# EAGLE design OTAVCF (EAGLE 9.5.2)
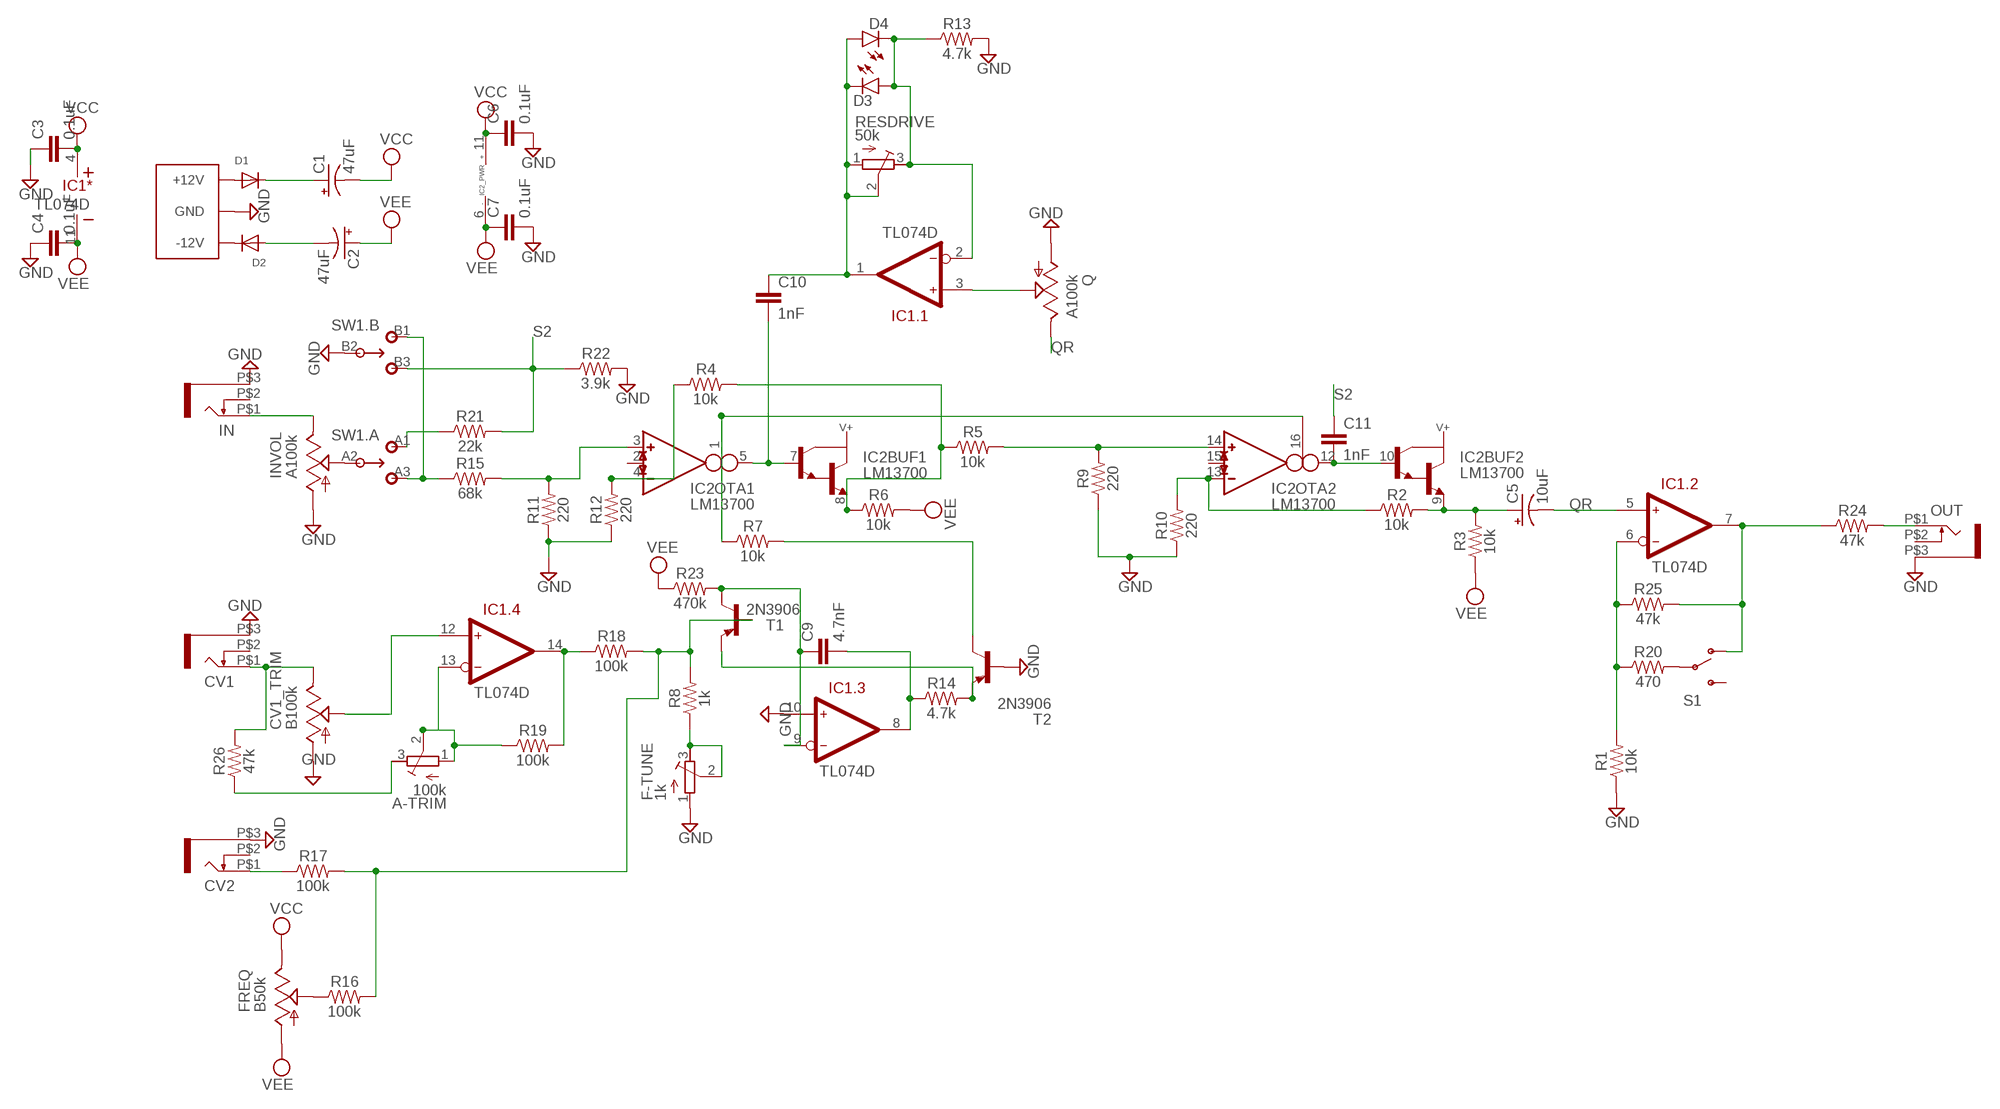
[diagram p0: schematic, sheet 1]

## Parts
A-TRIM  100k  R-TRIMM3296W  [RTRIM3296W]
C1  47uF  CAP_SMD+THRUPAN_B  [PAN_B_SMD+THRU]
C2  47uF  CAP_SMD+THRUPAN_B  [PAN_B_SMD+THRU]
C3  0.1uF  0.1UF-0603-25V-(+80/-20%)  [0603]
C4  0.1uF  0.1UF-0603-25V-(+80/-20%)  [0603]
C5  10uF  10UF-POLAR-RADIAL-2.5MM-25V-20%  [CPOL-RADIAL-2.5MM-5MM]
C6  0.1uF  0.1UF-0603-25V-(+80/-20%)  [0603]
C7  0.1uF  0.1UF-0603-25V-(+80/-20%)  [0603]
C9  4.7nF  0.1UF-0603-25V-(+80/-20%)  [0603]
C10  1nF  1.0NF/1000PF-0603-50V-10%  [0603]
C11  1nF  1.0NF/1000PF-0603-50V-10%  [0603]
CV1  WQP-PJ301M-12_JACK  [WQP-PJ301M-12_JACK]
CV1_TRIM  B100k  9MM_SNAP-IN_POT_  [9MM_SNAP-IN_POT]
CV2  WQP-PJ301M-12_JACK  [WQP-PJ301M-12_JACK]
D1  DIODESOD-123  [SOD-123]
D2  DIODESOD-123  [SOD-123]
D3  LED.3  [3MM_2]
D4  LED.3  [3MM_2]
F-TUNE  1k  R-TRIMM3296W  [RTRIM3296W]
FREQ  B50k  9MM_SNAP-IN_POT_  [9MM_SNAP-IN_POT]
IC1  TL074D  [SO-14]
IC2  LM13700  LM13X00_SMT  [SO16]
IN  WQP-PJ301M-12_JACK  [WQP-PJ301M-12_JACK]
INVOL  A100k  9MM_SNAP-IN_POT_  [9MM_SNAP-IN_POT]
OUT  WQP-PJ301M-12_JACK  [WQP-PJ301M-12_JACK]
Q  A100k  9MM_SNAP-IN_POT_  [9MM_SNAP-IN_POT]
R1  10k  10KOHM-0603-1/10W-1%  [0603]
R2  10k  10KOHM-0603-1/10W-1%  [0603]
R3  10k  10KOHM-0603-1/10W-1%  [0603]
R4  10k  10KOHM-0603-1/10W-1%  [0603]
R5  10k  10KOHM-0603-1/10W-1%  [0603]
R6  10k  10KOHM-0603-1/10W-1%  [0603]
R7  10k  10KOHM-0603-1/10W-1%  [0603]
R8  1k  1KOHM-0603-1/10W-1%  [0603]
R9  220  220OHM-0603-1/10W-1%  [0603]
R10  220  220OHM-0603-1/10W-1%  [0603]
R11  220  220OHM-0603-1/10W-1%  [0603]
R12  220  220OHM-0603-1/10W-1%  [0603]
R13  4.7k  4.7KOHM-0603-1/10W-1%  [0603]
R14  4.7k  4.7KOHM-0603-1/10W-1%  [0603]
R15  68k  RESISTOR0603  [0603]
R16  100k  100KOHM-0603-1/10W-1%  [0603]
R17  100k  100KOHM-0603-1/10W-1%  [0603]
R18  100k  100KOHM-0603-1/10W-1%  [0603]
R19  100k  100KOHM-0603-1/10W-1%  [0603]
R20  470  470OHM-0603-1/10W-1%  [0603]
R21  22k  22KOHM-0603-1/10W-1%  [0603]
R22  3.9k  3.9KOHM-0603-1/10W-1%  [0603]
R23  470k  RESISTOR0603  [0603]
R24  47k  47KOHM-0603-1/10W-1%  [0603]
R25  47k  47KOHM-0603-1/10W-1%  [0603]
R26  47k  47KOHM-0603-1/10W-1%  [0603]
RESDRIVE  50k  R-TRIMM3296W  [RTRIM3296W]
S1  SUBMINI_SPDT  [SUBMINI_TOGGLE]
SW1  DPDT.LUGS  [DPDT.LUGS]
T1  2N3906  BC807-40-PNP-SOT23-BEC  [SOT23-BEC]
T2  2N3906  BC807-40-PNP-SOT23-BEC  [SOT23-BEC]
U$1  EURO_POWER_LOCK  [EURO_PWR_HEADER_LOCK]

## Nets
BCVIN: R8.2 R16.2 R17.2 R18.2 T1.B
GND: C3.1 C4.1 C6.2 C7.2 CV1.P$3 CV1_TRIM.1(A) CV2.P$3 F-TUNE.1(A) IC1.10(.3:IN+) IN.P$3 INVOL.1(A) OUT.P$3 Q.1(A) R1.1 R9.1 R10.1 R11.1 R12.1 R13.2 R22.2 SW1.B2 T2.B U$1.GND1(GND) U$1.GND2(GND) U$1.GND3(GND) U$1.GND4(GND) U$1.GND5(GND) U$1.GND6(GND)
N$1: D1.A U$1.POS1(+12V) U$1.POS2(+12V)
N$2: D2.C U$1.NEG1(-12V) U$1.NEG2(-12V)
N$3: C1.+ C1.++(+) D1.C
N$4: C2.- C2.--(-) D2.A
N$5: IN.P$1 INVOL.3(E)
N$6: INVOL.2(S) SW1.A2
N$7: R15.1 SW1.A3 SW1.B1
N$8: R21.1 SW1.A1
N$9: CV1.P$1 CV1_TRIM.3(E) R26.2
N$10: A-TRIM.1(A) A-TRIM.2(S) IC1.13(.4:IN-) R19.1
N$11: IC1.14(.4:OUT) R18.1 R19.2
N$12: F-TUNE.2(S) F-TUNE.3(E) R8.1
N$13: CV2.P$1 R17.1
N$14: A-TRIM.3(E) R26.1
N$15: CV1_TRIM.2(S) IC1.12(.4:IN+)
N$16: FREQ.2(S) R16.1
N$17: C9.1 IC1.9(.3:IN-) R23.2 T1.C
N$18: C9.2 IC1.8(.3:OUT) R14.1
N$19: R14.2 T1.E T2.E
N$20: IC2.3(OTA1:IN_P) R11.2 R15.2
N$21: IC2.4(OTA1:IN_N) R4.1 R12.2
N$22: IC2.1(OTA1:I_BIAS) IC2.16(OTA2:I_BIAS) R7.1
N$23: R7.2 T2.C
N$24: IC2.8(BUF1:E) R4.2 R5.1 R6.1
N$25: C10.2 IC2.5(OTA1:OUT) IC2.7(BUF1:B)
N$26: C11.2 IC2.10(BUF2:B) IC2.12(OTA2:OUT)
N$27: IC2.14(OTA2:IN_P) R5.2 R9.2
N$28: IC2.13(OTA2:IN_N) R2.1 R10.2
N$29: C5.1(+) IC2.9(BUF2:E) R2.2 R3.2
N$30: IC1.6(.2:IN-) R1.2 R20.1 R25.1
N$31: R20.2 S1.COM(COMMON)
N$32: IC1.7(.2:OUT) R24.1 R25.2 S1.1(O)
N$33: OUT.P$1 R24.2
N$34: C10.1 D3.P$1(C) D4.ANODE(A) IC1.1(.1:OUT) RESDRIVE.1(A) RESDRIVE.2(S)
N$35: D3.ANODE(A) D4.P$1(C) IC1.2(.1:IN-) R13.1 RESDRIVE.3(E)
N$36: IC1.3(.1:IN+) Q.2(S)
QR: C5.2(-) IC1.5(.2:IN+) Q.3(E)
S2: C11.1 R21.2 R22.1 SW1.B3
VCC: C1.- C1.--(-) C3.2 C6.1 FREQ.3(E) IC1.4(*:V+) IC2.11(_PWR:V+)
VEE: C2.+ C2.++(+) C4.2 C7.1 FREQ.1(A) IC1.11(*:V-) IC2.6(_PWR:V-) R3.1 R6.2 R23.1
Unconnected: CV1.P$2 CV2.P$2 IC2.2(OTA1:I_DIODE) IC2.15(OTA2:I_DIODE) IN.P$2 OUT.P$2 S1.3(S)

## Library data of the parts
A-TRIM F-TUNE RESDRIVE = resistor:R-TRIMM: Trimm resistor
C1 C2 = MusicThingModular:CAP_SMD+THRU
C3 C4 C6 C7 = SparkFun-Capacitors:0.1UF: 0.1µF ceramic capacitors A capacitor is a passive two-terminal electrical component used to store electrical energy temporarily in an electric field.; PROD_ID: CAP-00810
C5 = SparkFun-Capacitors:10UF-POLAR: 10.0µF polarized capacitors A capacitor is a passive two-terminal electrical component used to store electrical energy temporarily in an electric field.; PROD_ID: CAP-08440
C9 = SparkFun-Capacitors:0.1UF: 0.1µF ceramic capacitors A capacitor is a passive two-terminal electrical component used to store electrical energy temporarily in an electric field.; PROD_ID: CAP-00810; VALUE: 0.1uF
C10 C11 = SparkFun-Capacitors:1.0NF/1000PF: 1nF/1,000pF ceramic capacitors A capacitor is a passive two-terminal electrical component used to store electrical energy temporarily in an electric field.; PROD_ID: CAP-07886
CV1 CV2 IN OUT = thonkiconn:WQP-PJ301M-12_JACK
CV1_TRIM FREQ INVOL Q = MusicThingModular:9MM_SNAP-IN_POT: 9mm vertical snap-in pot, Alpha / Panasonic style
D1 D2 = adafruit:DIODE: Diode SMADIODE - SMA Surface Mount Package 20V 1A Schottky Diode Digikey: 641-1014-6-ND DO-1N4148 - Through Hole Small Current Diode SOD-123 20V 1 A (.5mV Vf) Schottky Diode - Digikey: MBRX120TPMSCT-ND SOD-323 10V 570mA (.38mV Vf, 3ns) Schottky Diode - Digikey: ZLLS410CT-ND SOD-523 30V 30mA Schottky Diode (RB751S-40TE61) - Digikey: RB751S-40TE61CT-ND SOT23-R/W - SOT23 Package (R = Solder Paste/Reflow Ovens, W = Hand-Soldering) BAT54Film 40V 300mA - Digikey: 497-7162-1-ND
D3 D4 = diodes:LED: LEDs, all sizes 3mm: http://smallbear-electronics.mybigcommerce.com/led-t-1-3mm-diffused-colors/ 5mm: http://smallbear-electronics.mybigcommerce.com/led-t-1-3-4-5mm-diffused/
IC1 = ic-ti:TL074
IC2 = ota:LM13X00: Dual OTA with buffers Through Hole: LM13700: http://www.mouser.com/ProductDetail/Texas-Instruments/LM13700N-NOPB/?qs=sGAEpiMZZMtDSiRz%252bYolvD8n5VWKm6dLW3h72fOl2XA%3d LM13600: http://smallbear-electronics.mybigcommerce.com/ic-njm13600d/ Surface Mount: LM13700: http://www.mouser.com/ProductDetail/Texas-Instruments/LM13700MX-NOPB/?qs=sGAEpiMZZMtDSiRz%252bYolvD8n5VWKm6dLlyXbqS8bD%252bg%3d
R1-R7 = SparkFun-Resistors:10KOHM: 10kΩ resistor A resistor is a passive two-terminal electrical component that implements electrical resistance as a circuit element. Resistors act to reduce current flow, and, at the same time, act to lower voltage levels within circuits. - Wikipedia; PROD_ID: RES-00824
R8 = SparkFun-Resistors:1KOHM: 1kΩ resistor A resistor is a passive two-terminal electrical component that implements electrical resistance as a circuit element. Resistors act to reduce current flow, and, at the same time, act to lower voltage levels within circuits. - Wikipedia; PROD_ID: RES-07856
R9-R12 = SparkFun-Resistors:220OHM: 220Ω resistor A resistor is a passive two-terminal electrical component that implements electrical resistance as a circuit element. Resistors act to reduce current flow, and, at the same time, act to lower voltage levels within circuits. - Wikipedia; PROD_ID: RES-07861
R13 R14 = SparkFun-Resistors:4.7KOHM: 4.7kΩ resistor A resistor is a passive two-terminal electrical component that implements electrical resistance as a circuit element. Resistors act to reduce current flow, and, at the same time, act to lower voltage levels within circuits. - Wikipedia; PROD_ID: RES-07857
R15 R23 = SparkFun-Resistors:RESISTOR: Generic Resistor Package
R16-R19 = SparkFun-Resistors:100KOHM: 100kΩ resistor A resistor is a passive two-terminal electrical component that implements electrical resistance as a circuit element. Resistors act to reduce current flow, and, at the same time, act to lower voltage levels within circuits. - Wikipedia; PROD_ID: RES-07828
R20 = SparkFun-Resistors:470OHM: 470Ω resistor A resistor is a passive two-terminal electrical component that implements electrical resistance as a circuit element. Resistors act to reduce current flow, and, at the same time, act to lower voltage levels within circuits. - Wikipedia; PROD_ID: RES-07869
R21 = SparkFun-Resistors:22KOHM: 22kΩ resistor A resistor is a passive two-terminal electrical component that implements electrical resistance as a circuit element. Resistors act to reduce current flow, and, at the same time, act to lower voltage levels within circuits. - Wikipedia; PROD_ID: RES-07853
R22 = SparkFun-Resistors:3.9KOHM: 3.9kΩ resistor A resistor is a passive two-terminal electrical component that implements electrical resistance as a circuit element. Resistors act to reduce current flow, and, at the same time, act to lower voltage levels within circuits. - Wikipedia; PROD_ID: RES-08701
R24-R26 = SparkFun-Resistors:47KOHM: 47kΩ resistor A resistor is a passive two-terminal electrical component that implements electrical resistance as a circuit element. Resistors act to reduce current flow, and, at the same time, act to lower voltage levels within circuits. - Wikipedia; PROD_ID: RES-07871
S1 = MusicThingModular:SUBMINI_SPDT
SW1 = switches:DPDT: DPDT Switches
T1 T2 = MusicThingModular:*-PNP-: PNP Transistror
U$1 = MusicThingModular:EURO_POWER_LOCK

## Board
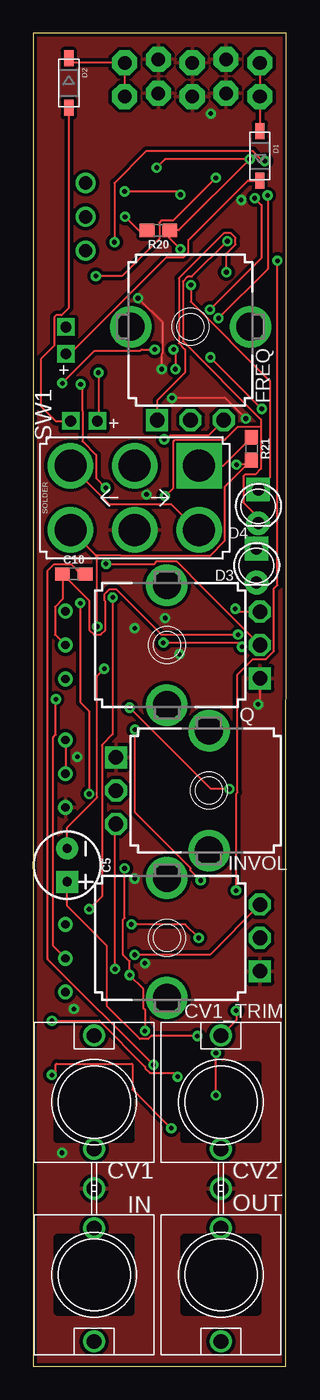
[diagram p1: board, top side]
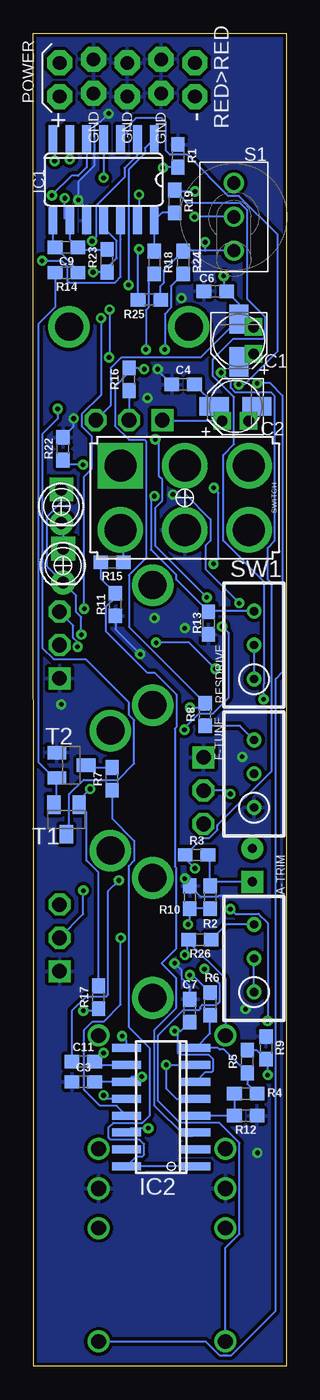
[diagram p2: board, bottom side, seen from below]

Size 19 x 100 mm. Coordinates in mm from the lower left corner, seen from the top.
Outline: 0,0 18.97,0 19,100 0,100 0,0
Copper layers (1*16): Top 0.035mm / dielectric 1.5mm / Bottom 0.035mm
Design rules "default *": minimum track width 6mil, minimum drill 0.35mm, track to track 6mil, track to pad 6mil, pad to pad 6mil, via to via 6mil, smd to smd 6mil, copper to edge 6mil, drill to drill 6mil, minimum pad ring 10mil, minimum via ring 8mil, stop-mask expansion 4mil, vias tented up to drill 0mil, thermal gap 10mil

### Footprints (pad centres in the part's own frame; a part is rotated, then mirrored left to right if it is on the bottom)
RTRIM3296W = drill 0.61: 1 0,-2.54; 2 0,0; 3 0,2.54
PAN_B_SMD+THRU = smd 2.2 x 1.4: + 1.6,0; - -1.6,0 | drill 0.8 pad 0.9 square: ++ 1,1.1; -- -1,1.1
0603 = smd 1.1 x 1: 1 -0.85,0; 2 0.85,0
CPOL-RADIAL-2.5MM-5MM = drill 0.7 pad 1.651 square: 1 1.25,0 | drill 0.7 pad 1.651: 2 -1.25,0
WQP-PJ301M-12_JACK = drill 1.1: P$1 0,5; P$2 0,-3.5; P$3 0,-6.5
9MM_SNAP-IN_POT = drill 1.1 square: 1 -2.5,-7 | drill 1.1 octagon: 2 0,-7; 3 2.5,-7 | drill 2.1 pad 2.794: CHASSIS1 -4.5,0; CHASSIS2 4.5,0
SOD-123 = smd 1.2 x 0.7: A 1.85,0; C -1.85,0
3MM_2 = drill 0.9 pad 1.778 square: ANODE -1.27,0 | drill 0.9 pad 1.778: P$1 1.27,0
SO-14 = smd 0.66 x 2.032: 1 -3.81,-3.073; 2 -2.54,-3.073; 3 -1.27,-3.073; 4 0,-3.073; 5 1.27,-3.073; 6 2.54,-3.073; 7 3.81,-3.073; 8 3.81,3.073; 9 2.54,3.073; 10 1.27,3.073; 11 0,3.073; 12 -1.27,3.073; 13 -2.54,3.073; 14 -3.81,3.073
SO16 = smd 0.6 x 2.2: 1 -4.445,-2.6; 2 -3.175,-2.6; 3 -1.905,-2.6; 4 -0.635,-2.6; 5 0.635,-2.6; 6 1.905,-2.6; 7 3.175,-2.6; 8 4.445,-2.6; 9 4.445,2.6; 10 3.175,2.6; 11 1.905,2.6; 12 0.635,2.6; 13 -0.635,2.6; 14 -1.905,2.6; 15 -3.175,2.6; 16 -4.445,2.6
SUBMINI_TOGGLE = drill 1 pad 1.422: 1 -2.54,0; 3 2.54,0; COM 0,0
DPDT.LUGS = drill 2.4 square: A1 -2.413,4.834 | drill 2.4: A2 -2.413,0.004; A3 -2.413,-4.826; B1 2.417,4.834; B2 2.417,0.004; B3 2.417,-4.826
SOT23-BEC = smd 1 x 1.4: B -0.95,-1.1; C 0,1.1; E 0.95,-1.1
EURO_PWR_HEADER_LOCK = drill 1.016 pad 1.88 octagon: GND1 -2.54,1.143; GND2 -2.54,-1.397; GND3 0,1.397; GND4 0,-1.143; GND5 2.54,1.143; GND6 2.54,-1.397; NEG1 -5.08,1.397; NEG2 -5.08,-1.143; POS1 5.08,1.397; POS2 5.08,-1.143

### Placement (x,y rotation side)
A-TRIM  2.41,30.61 0 bottom
C1  3.56,76.96 270 bottom
C2  3.81,72.01 180 bottom
C3  15.24,21.34 0 bottom
C4  7.75,73.66 0 bottom
C5  2.54,37.59 270 top
C6  5.33,80.64 180 bottom
C7  7.24,26.67 90 bottom
C9  16.51,83.95 180 bottom
C10  3.05,59.44 0 top
C11  15.24,22.86 0 bottom
CV1  4.57,19.81 0 top
CV1_TRIM  10.03,32.13 90 top
CV2  14.1,19.81 0 top
D1  17.02,90.81 90 top
D2  2.67,96.27 270 top
D3  16.76,60.07 270 top
D4  16.89,64.52 270 top
F-TUNE  2.41,44.45 0 bottom
FREQ  11.81,77.98 0 top
IC1  13.72,89.03 180 bottom
IC2  9.4,19.43 90 bottom
IN  4.57,6.86 180 top
INVOL  13.21,43.18 270 top
OUT  14.1,6.86 180 top
Q  10.03,54.1 90 top
R1  8.13,90.81 270 bottom
R2  5.71,35.18 90 bottom
R3  6.73,38.35 0 bottom
R4  3.05,20.45 0 bottom
R5  2.92,22.86 90 bottom
R6  5.71,27.18 90 bottom
R7  13.08,44.07 90 bottom
R8  6.1,48.9 90 bottom
R9  1.52,23.88 270 bottom
R10  7.24,35.18 270 bottom
R11  12.83,57.15 90 bottom
R12  3.05,18.8 180 bottom
R13  5.84,55.75 270 bottom
R14  16.51,82.04 180 bottom
R15  13.08,60.33 180 bottom
R16  11.81,74.04 90 bottom
R17  14.1,27.69 90 bottom
R18  9.91,82.8 270 bottom
R19  8.38,87.38 270 bottom
R20  9.4,85.22 180 top
R21  16.38,68.83 270 top
R22  16.76,68.83 90 bottom
R23  13.46,82.93 90 bottom
R24  7.75,82.8 270 bottom
R25  10.29,80.01 0 bottom
R26  6.48,32 180 bottom
RESDRIVE  2.41,54.1 0 bottom
S1  3.94,86.23 90 bottom
SW1  7.62,65.15 270 top
T1  16.51,41.02 180 bottom
T2  16.13,45.09 270 bottom
U$1  11.94,96.65 180 bottom

### Tracks (layer width: path | path; a pad name or v marks a point on that pad's centre or on a via)
BCVIN  (via drill 0.35)
  Top 0.152: v14.73,43.31 13.34,43.31 v7.24,49.4 | v10.54,76.28 10.67,76.15 v10.67,74.8
  Bottom 0.152: 6.18,49.83 11.82,55.47 11.82,59.34 10.52,60.64 10.52,69.37 10.65,69.5 11.82,69.5 12.87,70.54 12.87,73.51 11.81,74.56 R16.2 11.14,74.89 11.05,74.8 v10.67,74.8 | 6.18,49.83 R8.2 | R17.2 14.1,37.04 14.99,37.94 14.99,41.56 T1.B 15.56,42.48 v14.73,43.31 | v7.24,49.4 6.6,49.4 6.18,49.83 | v10.54,76.28 10.54,79.23 10.36,79.42 10.36,81.5 R18.2
GND  (via drill 0.35)
  Top 0.152: v15.97,71.09 14.42,72.64 v10.41,72.64 | v9.65,74.8 9.65,75.95 9.73,76.03 9.73,78.28 v7.87,80.14 | Q.1 17.03,49.8 v16.89,49.66
  Bottom 0.152: 4.19,35.31 5.07,35.31 5.12,35.25 6.46,35.25 R10.1 | R22.2 15.97,70.48 v15.97,71.09 | C4.1 9.65,74.72 v9.65,74.8 | C7.2 7.24,28.48 7.85,29.09 7.85,29.69 v8.38,30.23 | R11.1 12.83,55.28 v10.97,53.42 | v13.34,93.98 13.97,93.34 14.14,93.34 14.43,93.06 14.43,90.08 15.62,88.88 v15.62,87.5 14.99,86.87 IC1.10
  other vias: 2.16,16 3.05,26.8 9.91,56.13 3.3,45.72 7.62,36.58 7.62,55.37 8.51,65.41
  pour Top (isolate 0.254): -1.02,101.85 -1.02,0.25 0,-0.76 18.92,-0.76 20.19,0.51 20.19,100.33 19.43,101.09 -0.25,101.09
  pour Bottom (isolate 0.254): -0.25,100.33 -0.25,-1.4 -0.38,-1.52 19.56,-1.52 20.45,-0.64 20.45,100.84 20.32,100.97 0.38,100.97
N$1
  Top 0.152: U$1.POS2 U$1.POS1 D1.A
N$2
  Top 0.152: U$1.NEG1 U$1.NEG2 2.99,97.79 D2.C
N$3
  Top 0.152: D1.C 16.13,88.95 11.66,84.48 11.66,83.57 11.3,83.21 10.02,83.21 2.77,75.96 C1.++
  Bottom 0.152: C1.++ 2.96,75.96 C1.+
N$4
  Top 0.152: D2.A 2.67,79.38 2.13,78.84 1.71,78.84 1.57,78.71 1.57,76.58 0.56,75.56 0.56,72.02 1.67,70.91 C2.--
  Bottom 0.152: C2.-- 2.81,71.41 C2.-
N$5  (via drill 0.35)
  Top 0.152: v6.14,29.8 6.14,40.62 INVOL.3
  Bottom 0.152: v6.14,29.8 5.15,28.81 5.12,28.81 4.99,28.67 4.99,27.38 5.26,27.11 6.31,27.11 6.44,26.97 6.44,26.82 6.53,26.73 7.71,26.73 9.62,24.81 9.62,19.9 7.99,18.27 5.04,18.27 3.52,16.75 3.52,9.92 4.57,8.87 IN.P$1
N$6  (via drill 0.35)
  Top 0.152: v3.53,57.25 3.53,49.81 4.19,49.15 v4.19,42.93
  Bottom 0.152: SW1.A2 7.62,65.47 5.69,63.54 5.69,61.93 6.07,61.55 6.07,59.79 v3.53,57.25 | v4.19,42.93 4.45,43.18 INVOL.2
N$7
  Top 0.152: SW1.A3 5.69,64.67 10.33,64.67 12.27,62.73 SW1.B1
  Bottom 0.152: R15.1 12.23,62.51 SW1.B1
N$8
  Top 0.152: SW1.A1 14.26,67.56 R21.1
N$9  (via drill 0.35)
  Top 0.152: CV1_TRIM.3 13.26,30.86 v7.62,30.86
  Bottom 0.152: CV1.P$1 4.57,29.08 7.33,31.84 R26.2 7.41,32.09 7.41,31.07 v7.62,30.86
N$10  (via drill 0.35)
  Top 0.152: v1.7,50.04 1.7,47.39 1.49,47.18 1.49,31.53 A-TRIM.2 | v6.86,88.14 10.8,88.14 v11.05,87.89
  Bottom 0.152: A-TRIM.1 A-TRIM.2 | v1.7,50.04 1.7,51.16 1.63,51.24 1.63,58.83 4.73,61.93 4.73,68.37 3.93,69.17 3.93,72.72 5.5,74.29 5.5,75.54 3.96,77.08 1.71,77.08 1.57,77.21 1.57,78.71 2.92,80.06 2.92,86.74 3.43,87.25 7.41,87.25 R19.1 8.29,88.14 v6.86,88.14 | v11.05,87.89 11.05,86.08 IC1.13
N$11
  Bottom 0.152: R18.1 IC1.14 9.33,86.53 R19.2
N$12
  Top 0.152: F-TUNE.3 F-TUNE.2
  Bottom 0.152: F-TUNE.3 3.47,48.05 R8.1
N$13  (via drill 0.35)
  Top 0.152: v15.24,26.67 15.24,25.95 CV2.P$1
  Bottom 0.152: R17.1 14.26,26.67 v15.24,26.67
N$14
  Bottom 0.152: A-TRIM.3 4.48,33.15 R26.1
N$15  (via drill 0.35)
  Top 0.152: v15.24,35.69 15.24,42.96 15.34,43.06 15.34,51.88 16.51,53.05 17.47,53.05 18.09,53.67 18.09,58.35 18.34,58.6 v18.34,82.93
  Bottom 0.152: CV1_TRIM.2 15.24,33.92 v15.24,35.69 | IC1.12 12.45,84.57 12.43,84.55 12.43,81.74 12.87,81.3 16.29,81.3 16.44,81.45 16.44,82.49 16.88,82.93 v18.34,82.93
N$16
  Bottom 0.152: R16.1 FREQ.2
N$17  (via drill 0.35)
  Top 0.152: v16.64,87.63 17.14,87.12 17.14,83.15 v13.28,79.28 | v13.31,75.69 v17.17,71.82
  Bottom 0.152: R23.2 15.49,83.78 C9.1 16.26,84.54 IC1.9 16.64,86.11 v16.64,87.63 | T1.C 16.29,40.14 16.29,42.92 15.21,44 12.63,44 11.42,45.2 11.42,48.46 11.82,48.86 11.82,49.78 15.08,53.05 17.47,53.05 18.31,53.89 18.31,69.94 17.17,71.08 v17.17,71.82 | v13.28,79.28 13.28,75.72 v13.31,75.69
N$18
  Bottom 0.152: IC1.8 17.53,84.11 17.38,83.97 C9.2 15.66,82.25 R14.1
N$19
  Bottom 0.152: T1.E 17.23,42.35 17.23,43.94 | 17.23,43.94 T2.E | R14.2 17.36,79.46 18.62,78.2 18.62,45.33 17.23,43.94
N$20
  Bottom 0.152: IC2.3 7.05,17.27 7.62,17.27 9.93,19.58 9.93,25.21 8.25,26.89 8.25,29.11 9.37,30.23 8.25,31.35 8.25,37.37 8.36,37.48 8.36,47.84 8.25,47.95 8.25,50.38 9.91,52.04 10.45,52.04 13.56,55.15 13.56,56.95 12.83,57.67 R11.2 13.93,59.1 R15.2
N$21
  Bottom 0.152: R4.1 R12.2 IC2.4
N$22
  Bottom 0.152: IC2.1 IC2.16 11.26,15.73 10.8,15.73 10.67,15.86 10.67,16.65 11.02,17 13.19,17 13.33,17.13 13.33,17.92 12.98,18.27 10.8,18.27 10.24,18.83 10.24,23.84 11.82,25.42 11.82,37.54 11.42,37.94 11.42,39.42 13.08,41.08 R7.1
N$23
  Bottom 0.152: T2.C 14.86,44.92 R7.2
N$24
  Bottom 0.152: R6.1 5.71,24.96 IC2.8 5.13,23.88 5.01,23.76 4.67,23.76 R5.1 2.92,21.17 R4.2
N$25  (via drill 0.35)
  Top 0.152: C10.2 3.57,59.44 2.84,60.16 1.55,60.16 1.09,59.7 1.09,30.53 v9.02,22.61
  Bottom 0.152: IC2.7 v9.02,22.61 9.02,20.83 8.26,20.07 IC2.5
N$26  (via drill 0.35)
  Top 0.152: v13.72,20.32 v13.72,23.5
  Bottom 0.152: IC2.10 14.14,22.61 C11.2 13.76,23.5 v13.72,23.5 | IC2.12 13.46,20.07 v13.72,20.32
N$27  (via drill 0.35)
  Top 0.152: v10.36,17.85 7.45,20.76 7.45,22.64 7.4,22.69 1.74,22.69 1.7,22.64 1.7,22.15 v1.39,21.84
  Bottom 0.152: R5.2 2.21,23.71 R9.2 1.39,22.9 v1.39,21.84 | v10.36,17.85 11.67,17.85 IC2.14
N$28  (via drill 0.35)
  Top 0.152: v12.43,32.13 11.41,33.15 v7.37,33.15
  Bottom 0.152: R2.1 R10.2 7.24,33.27 v7.37,33.15 | IC2.13 12.74,19.54 13.96,19.54 15.17,20.74 15.17,25.23 14.53,25.87 13.69,25.87 12.43,27.13 v12.43,32.13
N$29  (via drill 0.35)
  Top 0.152: C5.1 2.54,34.54 5.54,31.55 5.54,27.01 8,24.54 8.63,24.54 8.86,24.77 v12.32,24.77
  Bottom 0.152: C5.1 5.4,36.34 R2.2 5.71,38.19 R3.2 | IC2.9 12,24.44 v12.32,24.77
N$30  (via drill 0.35)
  Top 0.152: v11.05,83.82 10.25,84.62 R20.1 10.92,85.22 v16.26,90.55 9.91,90.55 v9.27,89.92
  Bottom 0.152: R25.1 11.14,83.73 v11.05,83.82 | IC1.6 16.31,92.05 16.31,90.6 v16.26,90.55 | R1.2 9.23,89.95 v9.27,89.92
N$31  (via drill 0.35)
  Top 0.152: v6.9,86.23 7.91,85.22 R20.2
  Bottom 0.152: S1.COM v6.9,86.23
N$32  (via drill 0.35)
  Top 0.152: v17.4,90.42 17.24,90.42 16.51,91.16 8.48,91.16 6.1,88.77 v6.1,84.33
  Bottom 0.152: R25.2 9.44,81.05 9.18,81.31 9.18,82.22 R24.1 7.71,83.69 6.1,83.69 | S1.1 6.1,83.69 | IC1.7 17.4,91.97 v17.4,90.42 | v6.1,84.33 6.1,83.69
N$33  (via drill 0.35)
  Top 0.152: v9.12,76.28 8.14,76.28 8.05,76.19 4.62,76.19 v2.18,73.75
  Bottom 0.152: R24.2 8.66,81.04 8.66,79.42 9.12,78.95 v9.12,76.28 | v2.18,73.75 1.19,73.75 0.28,72.84 0.28,52.07 0.79,51.56 0.79,4.15 4.14,0.8 5.01,0.8 6.06,1.86 OUT.P$1
N$34  (via drill 0.35)
  Top 0.152: RESDRIVE.2 1.63,54.89 1.63,56.97 2.2,57.54 C10.1 4.21,57.43 4.21,55.25 4.56,54.89 5.06,54.89 5.42,55.25 5.42,57.38 5.36,57.43 5.36,57.94 5.72,58.29 6.22,58.29 9.62,54.89 v15.39,54.89 | v11.84,81.12 11.84,79.85 17.78,73.91 17.78,66.67 D4.ANODE
  Bottom 0.152: IC1.1 10.62,91.39 10.62,90.99 11.84,89.76 v11.84,81.12 | D4.ANODE 16.89,64.83 18.01,63.71 18.01,60.05 D3.P$1 15.77,57.81 15.77,56.58 15.39,56.19 v15.39,54.89 | RESDRIVE.2 RESDRIVE.1
N$35  (via drill 0.35)
  Top 0.152: D4.P$1 16.89,63.69 15.77,64.8 15.77,66.77 15.91,66.9 16.68,66.9 17.11,67.34 17.11,70.48 | 17.11,70.48 17.11,71.03 11.24,76.9 11.24,81.37 11.59,81.73 11.9,81.73 v14.58,84.41 | 17.11,70.48 15.37,70.48 14.38,69.5 10.65,69.5 10.52,69.37 10.52,65.89 v9.91,65.28
  Bottom 0.152: RESDRIVE.3 5.8,56.64 R13.1 8.25,59.01 8.25,59.34 10.16,61.26 10.16,65.02 v9.91,65.28 | D4.P$1 16.76,63.12 D3.ANODE | IC1.2 11.18,90.86 12.15,89.89 12.15,89.19 14.28,87.06 14.28,84.71 v14.58,84.41
N$36  (via drill 0.35)
  Top 0.152: v3.56,73.66 3.68,73.53 3.68,71.67 3.69,71.66 3.69,69.4 4.73,68.37 4.73,66.61 v5.45,65.9 | v5.46,60.2 9.1,60.2 9.29,60.39 10.77,60.39 11.82,59.34 11.82,59.31 Q.2
  Bottom 0.152: v3.56,73.66 3.13,73.66 0.63,76.15 0.63,84.89 3.54,87.79 4.34,87.79 7.43,90.88 8.72,90.88 9.04,91.2 9.04,93.34 9.36,93.65 11.3,93.65 11.73,93.21 11.73,92.81 IC1.3 | v5.46,60.2 5.08,60.58 5.08,65.53 v5.45,65.9
QR  (via drill 0.35)
  Top 0.152: v17.6,87.84 17.6,82.32 v13.92,78.64 | v15.17,56.83 15.39,56.6 Q.3 | v5.33,52.32 4.8,51.79 4.8,42.67 2.54,40.42 C5.2 | v9.77,54.28 15.38,54.28 v15.68,53.98
  Bottom 0.152: v17.6,87.84 16.13,89.31 15.62,89.31 14.99,89.95 IC1.5 | v13.92,78.64 13.92,72.86 15.37,71.41 15.37,70.54 14.58,69.76 14.58,67.34 15.17,66.76 v15.17,56.83 | v5.33,52.32 7.29,54.28 v9.77,54.28 | v15.68,53.98 15.68,54.32 16,54.64 16,55.57 Q.3
S2  (via drill 0.35)
  Top 0.152: v15.27,67.64 16.04,67.64 R21.2 14.39,65.99 14.39,61.93 13.26,60.8 6.61,60.8 6.6,60.8 4.72,60.8 | v12.57,36.45 11.82,37.2 11.82,37.37 7.64,41.55 v7.64,47.75 | 4.72,60.8 4.81,60.72 v4.81,55.5 | 4.72,60.8 SW1.B3
  Bottom 0.152: v15.27,67.64 16.42,67.64 R22.1 | v12.57,36.45 13.37,35.65 13.37,27.89 13.5,27.76 15.01,27.76 16.09,26.68 C11.1 | v7.64,47.75 7.64,47.88 6.55,48.97 5.5,48.97 4.35,50.12 4.35,55.04 v4.81,55.5
VCC  (via drill 0.35)
  Top 0.152: v4.7,81.79 6.66,81.79 9.47,84.6 9.47,85.81 9.6,85.95 10.51,85.95 v13.72,89.15 | v9.84,69.54 10.01,69.54 10.27,69.81 13.14,69.81 FREQ.3 | v5.97,57.68 5.97,47.41 5.15,46.6 5.15,35.25 v4.19,34.29 | v1.4,25.91 4.97,25.91 8.41,22.46 8.41,22.36 8.77,22 10.56,22 v10.84,21.72
  Bottom 0.152: C1.- 3.56,79.72 C6.1 4.7,80.86 v4.7,81.79 | C1.- 2.96,77.96 C1.-- | FREQ.3 13.17,72.12 13.17,74.91 12.41,75.67 6.45,75.67 C1.- | C3.2 IC2.11 11.62,21.72 v10.84,21.72 | IC1.4 v13.72,89.15 | v4.19,34.29 3.83,33.93 2.09,33.93 1.4,33.24 v1.4,25.91 | v9.84,69.54 9.56,69.27 9.56,66.76 9.3,66.5 9.3,64.94 9.81,64.42 9.81,61.53 v5.97,57.68
VEE  (via drill 0.35)
  Top 0.152: v8.38,25.15 8.38,26.75 8.25,26.89 8.25,28.33 v7.24,29.34 7.24,30.38 6.76,30.86 6.76,33.52 6.86,33.62 v6.86,37.34 | FREQ.1 9.31,72.46 11.4,74.55 11.4,76.27 10.93,76.74 10.93,81.62 14.33,85.01 14.83,85.01 15.19,84.66 15.19,84.16 14.5,83.47 v14.5,82.08 | v4.89,74.55 4.89,70.99 C2.++
  Bottom 0.152: C4.2 5.41,72.17 C2.+ 5.41,71.51 C2.++ 9.24,70.91 FREQ.1 | IC2.6 6.06,22.08 5.6,22.08 5.47,22.21 5.47,23 5.82,23.35 7.99,23.35 8.13,23.48 8.13,24.89 v8.38,25.15 7.91,25.15 C7.1 | IC1.11 13.46,85.7 13.46,85.15 12.73,84.43 12.73,83.14 13.46,82.41 R23.1 v14.5,82.08 | R6.2 7.02,29.34 v7.24,29.34 | v6.86,37.34 7.58,38.06 R3.1 6.31,39.63 5.77,39.63 5.15,40.24 5.15,40.59 1.09,44.66 1.09,58.72 1.4,59.03 1.4,61.39 0.86,61.93 0.86,72.78 1.13,73.05 3.81,73.05 4.16,73.41 4.16,73.81 v4.89,74.55